# EAGLE schematic Timer_SHO (EAGLE 7.0.0)
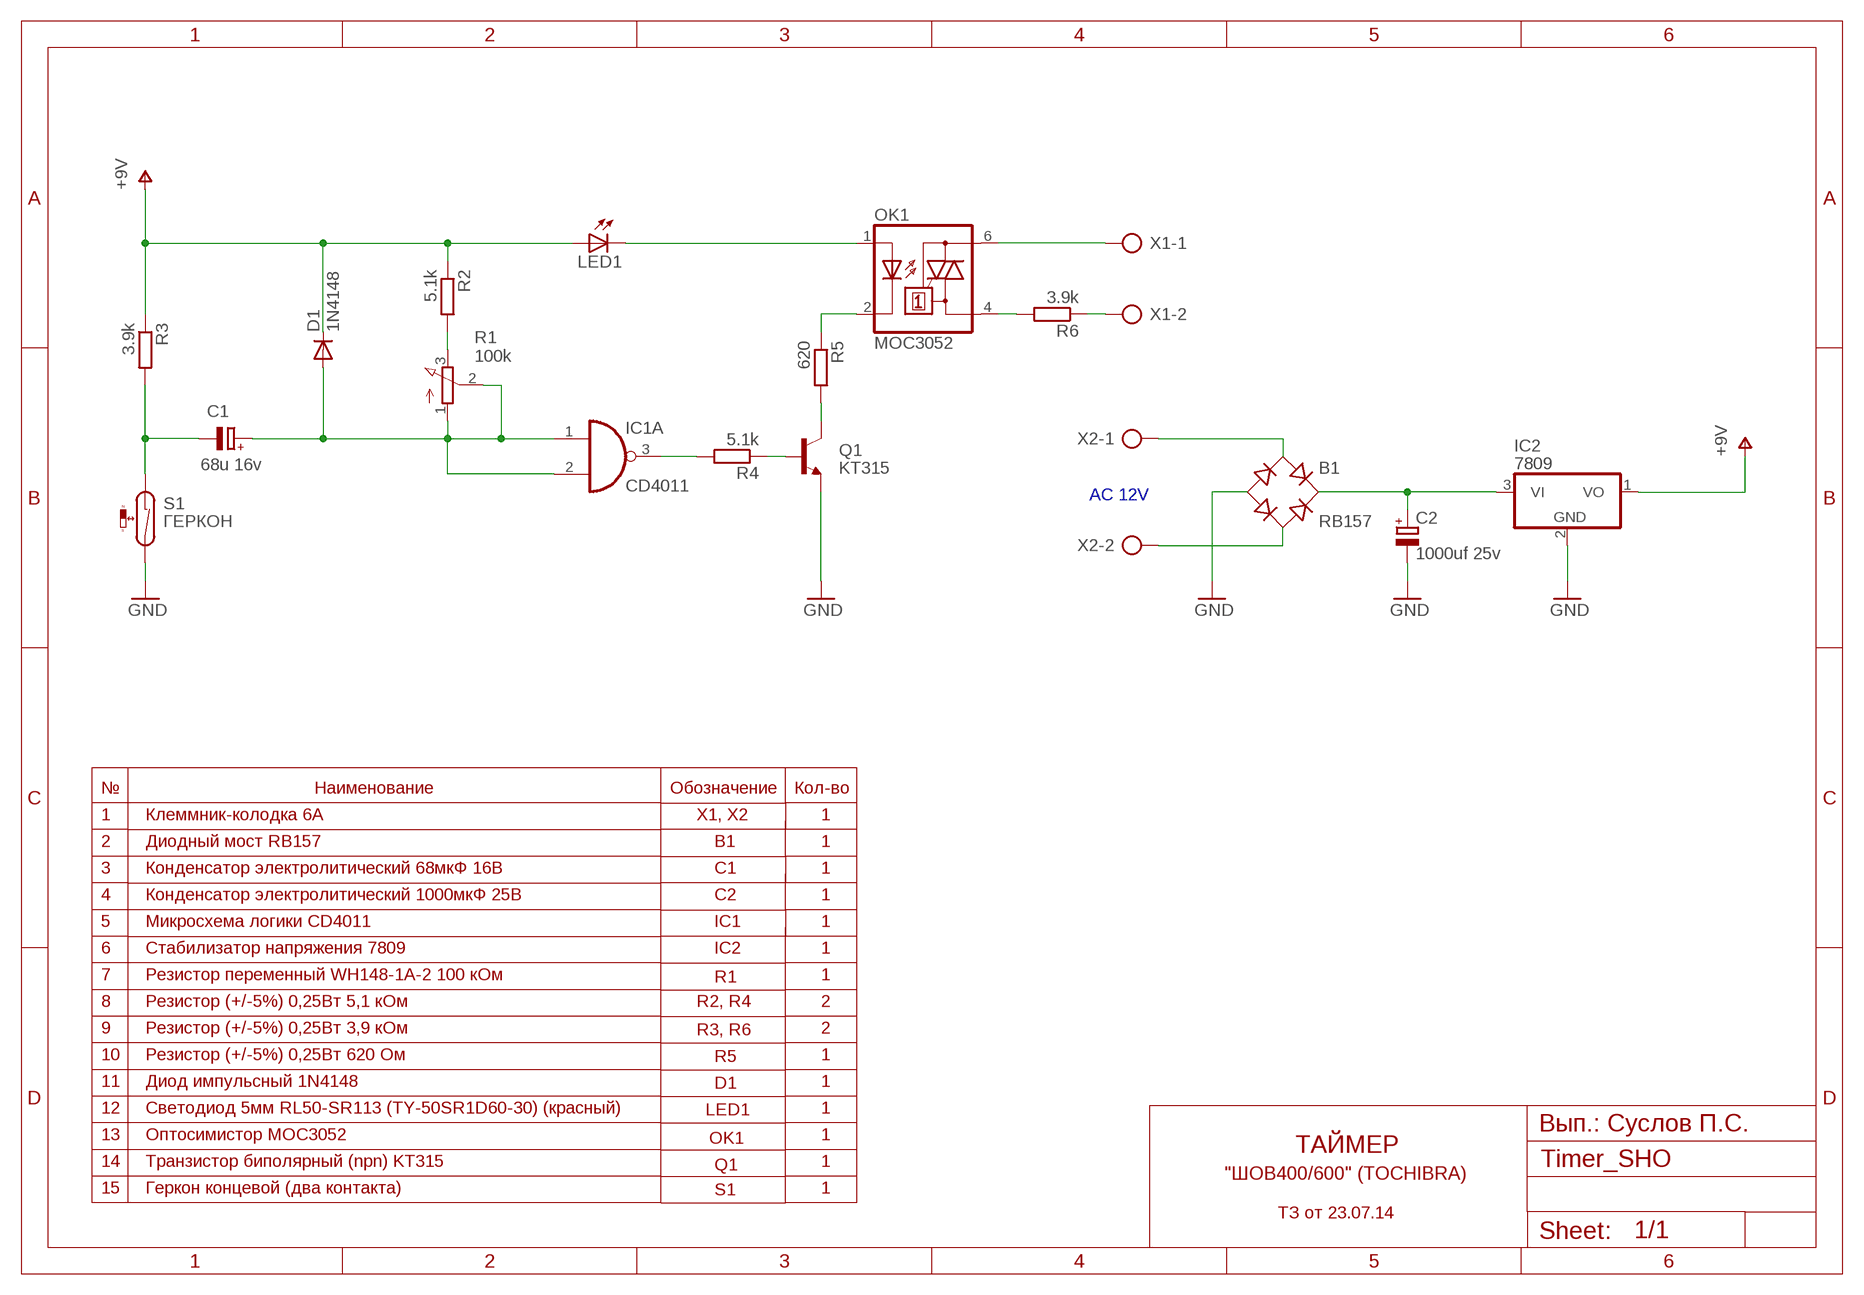
[diagram p0: schematic, sheet 1]

## Parts
B1  RB157  B-DIL  [B-DIL]
C1  68u 16v  CPOL-EU085CS-1AR  [085CS_1AR]
C2  1000uf 25v  CPOL-EU085CS-1AR  [085CS_1AR]
D1  1N4148  1N4004  [DO41-10]
IC1  CD4011  74AC00N  [DIL14]
IC2  7809  7808L  [TO92]
LED1  LED5MM  [LED5MM]
OK1  MOC3052  MOC3031T  [DIL06B]
Q1  KT315  BC237  [TO92]
R1  100k  3RP/1610N  [3RP/1610N]
R2  5.1k  R-EU_0309/10  [0309/10]
R3  3.9k  R-EU_0309/10  [0309/10]
R4  5.1k  R-EU_0309/10  [0309/10]
R5  620  R-EU_0309/10  [0309/10]
R6  3.9k  R-EU_0309/10  [0309/10]
S1  ГЕРКОН  REED-SWITCH-CT10-A2  [CT10-A2]
X1  AK500/2  [AK500/2]
X2  AK500/2  [AK500/2]

## Nets
GND: B1.- C2.- IC2.2(GND) Q1.1(E) S1.2
N$1: C1.+ D1.A IC1.1(A:I0) IC1.2(A:I1) R1.1(A) R1.2(S)
N$2: R1.3(E) R2.2
N$3: OK1.4(A1) R6.2
N$4: C1.- R3.2 S1.1
N$5: OK1.6(A2) X1.1
N$6: R6.1 X1.2
N$7: LED1.K(C) OK1.1(A)
N$8: OK1.2(C) R5.1
N$9: Q1.3(C) R5.2
N$10: Q1.2(B) R4.1
N$11: IC1.3(A:O) R4.2
N$12: B1.+ C2.+ IC2.3(VI)
N$13: B1.AC2 X2.2
N$14: B1.AC1 X2.1
V+: D1.C IC2.1(VO) LED1.A R2.1 R3.1 ; supply symbol labelled +9V
Unconnected: IC1.4(B:I0) IC1.5(B:I1) IC1.6(B:O) IC1.8(C:O) IC1.9(C:I0) IC1.10(C:I1) IC1.11(D:O) IC1.12(D:I0) IC1.13(D:I1)

## Notes on the sheet
- AC 12V
- № | Наименование | Обозначение | Кол-во
- 1 | Клеммник-колодка 6A | X1, X2 | 1
- 2 | Диодный мост RB157 | B1 | 1
- 3 | Конденсатор электролитический 68мкФ 16В | C1 | 1
- 4 | Конденсатор электролитический 1000мкФ 25В | C2 | 1
- 5 | Микросхема логики CD4011 | IC1 | 1
- 6 | Стабилизатор напряжения 7809 | IC2 | 1
- 7 | Резистор переменный WH148-1A-2 100 кОм | R1 | 1
- 8 | Резистор (+/-5%) 0,25Вт 5,1 кОм | R2, R4 | 2
- 9 | Резистор (+/-5%) 0,25Вт 3,9 кОм | R3, R6 | 2
- 10 | Резистор (+/-5%) 0,25Вт 620 Ом | R5 | 1
- 11 | Диод импульсный 1N4148 | D1 | 1
- 12 | Светодиод 5мм RL50-SR113 (TY-50SR1D60-30) (красный) | LED1 | 1
- Вып.: Суслов П.С.
- 13 | Оптосимистор МОС3052 | OK1 | 1
- ТАЙМЕР
- 14 | Транзистор биполярный (npn) KT315 | Q1 | 1
- "ШОВ400/600" (TOCHIBRA)
- 15 | Геркон концевой (два контакта) | S1 | 1
- ТЗ от 23.07.14

## Power pins joined to a net without a drawn wire
GND: IC1.7(P:GND)
VCC: IC1.14(P:VCC)

## Library data of the parts
B1 = rectifier:B-DIL: RECTIFIER
C1 C2 = rcl:CPOL-EU: POLARIZED CAPACITOR, European symbol
D1 = diode:1N4004: DIODE general purpose rectifier, 1 A
IC1 = 74xx-eu:74*00: Quad 2-input NAND gate
IC2 = linear:78*: Positive VOLTAGE REGULATOR Source: http://cache.national.com/ds/LM/LM78L05.pdf http://www.fairchildsemi.com/ds/LM/LM7805.pdf
LED1 = led:LED: LED OSRAM: - CHIPLED LG R971, LG N971, LY N971, LG Q971, LY Q971, LO R971, LY R971 LH N974, LH R974 LS Q976, LO Q976, LY Q976 LO Q996 - Hyper CHIPLED LW Q18S LB Q993, LB Q99A, LB R99A - SideLED LS A670, LO A670, LY A670, LG A670, LP A670 LB A673, LV A673, LT A673, LW A673 LH A674 LY A675 LS A676, LA A676, LO A676, LY A676, LW A676 LS A679, LY A679, LG A679 - Hyper Micro SIDELED® LS Y876, LA Y876, LO Y876, LY Y876 LT Y87S - SmartLED LW L88C, LW L88S LB L89C, LB L89S, LG L890 LS L89K, LO L89K, LY L89K LS L896, LA L896, LO L896, LY L896 - TOPLED LS T670, LO T670, LY T670, LG T670, LP T670 LSG T670, LSP T670, LSY T670, LOP T670, LYG T670 LG T671, LOG T671, LSG T671 LB T673, LV T673, LT T673, LW T673 LH T674 LS T676, LA T676, LO T676, LY T676, LB T676, LH T676, LSB T676, LW T676 LB T67C, LV T67C, LT T67C, LS T67K, LO T67K, LY T67K, LW E67C LS E67B, LA E67B, LO E67B, LY E67B, LB E67C, LV E67C, LT E67C LW T67C LS T679, LY T679, LG T679 LS T770, LO T770, LY T770, LG T770, LP T770 LB T773, LV T773, LT T773, LW T773 LH T774 LS E675, LA E675, LY E675, LS T675 LS T776, LA T776, LO T776, LY T776, LB T776 LHGB T686 LT T68C, LB T68C - Hyper Mini TOPLED® LB M676 - Mini TOPLED Santana® LG M470 LS M47K, LO M47K, LY M47K Source: http://www.osram.convergy.de LUXEON: - LUMILED® LXK2-PW12-R00, LXK2-PW12-S00, LXK2-PW14-U00, LXK2-PW14-V00 LXK2-PM12-R00, LXK2-PM12-S00, LXK2-PM14-U00 LXK2-PE12-Q00, LXK2-PE12-R00, LXK2-PE12-S00, LXK2-PE14-T00, LXK2-PE14-U00 LXK2-PB12-K00, LXK2-PB12-L00, LXK2-PB12-M00, LXK2-PB14-N00, LXK2-PB14-P00, LXK2-PB14-Q00 LXK2-PR12-L00, LXK2-PR12-M00, LXK2-PR14-Q00, LXK2-PR14-R00 LXK2-PD12-Q00, LXK2-PD12-R00, LXK2-PD12-S00 LXK2-PH12-R00, LXK2-PH12-S00 LXK2-PL12-P00, LXK2-PL12-Q00, LXK2-PL12-R00 Source: www.luxeon.com KINGBRIGHT: KA-3528ASYC Source: www.kingbright.com
OK1 = optocoupler:MOC30*: 6-Pin DIP Zero-Cross Optoisolators Triac Driver Output (250/400 Volt Peak) Source: Data sheet <http://www.fairchildsemi.com/ds/MO/MOC3031M.pdf> The old path of data sheet not more available 2013-05-06.; OC_FARNELL: unknown; OC_NEWARK: unknown
Q1 = transistor-npn:BC237: NPN Transistor
R1 = pot:3RP/1610N: 16mm Potentiometer one level Source: http://www.alphapotentiometers.net/html/16mm_pot_2.html
R2-R6 = rcl:R-EU_: RESISTOR, European symbol
S1 = switch-reed:REED-SWITCH-: Reed Sensor; OC_FARNELL: unknown
X1 X2 = con-ptr500:AK500/2: CONNECTOR; OC_FARNELL: unknown; OC_NEWARK: unknown